# EAGLE design qo-100-pa-tec-controller (EAGLE 9.6.1)
CNAME: None; CREVISION: 1; DESIGNER: Joao Silva
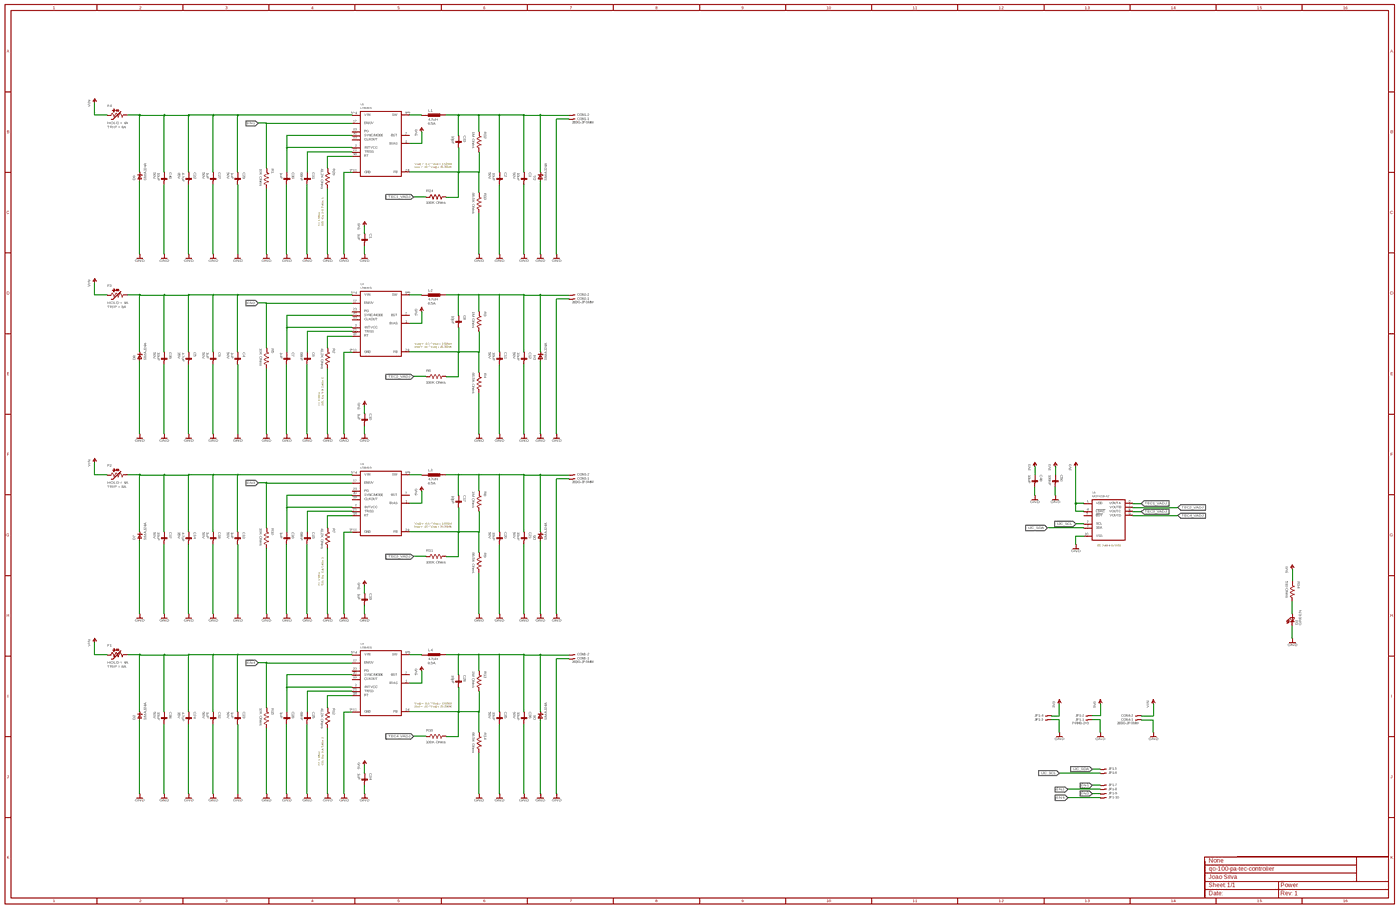
[diagram p0: schematic, sheet 1, overview]
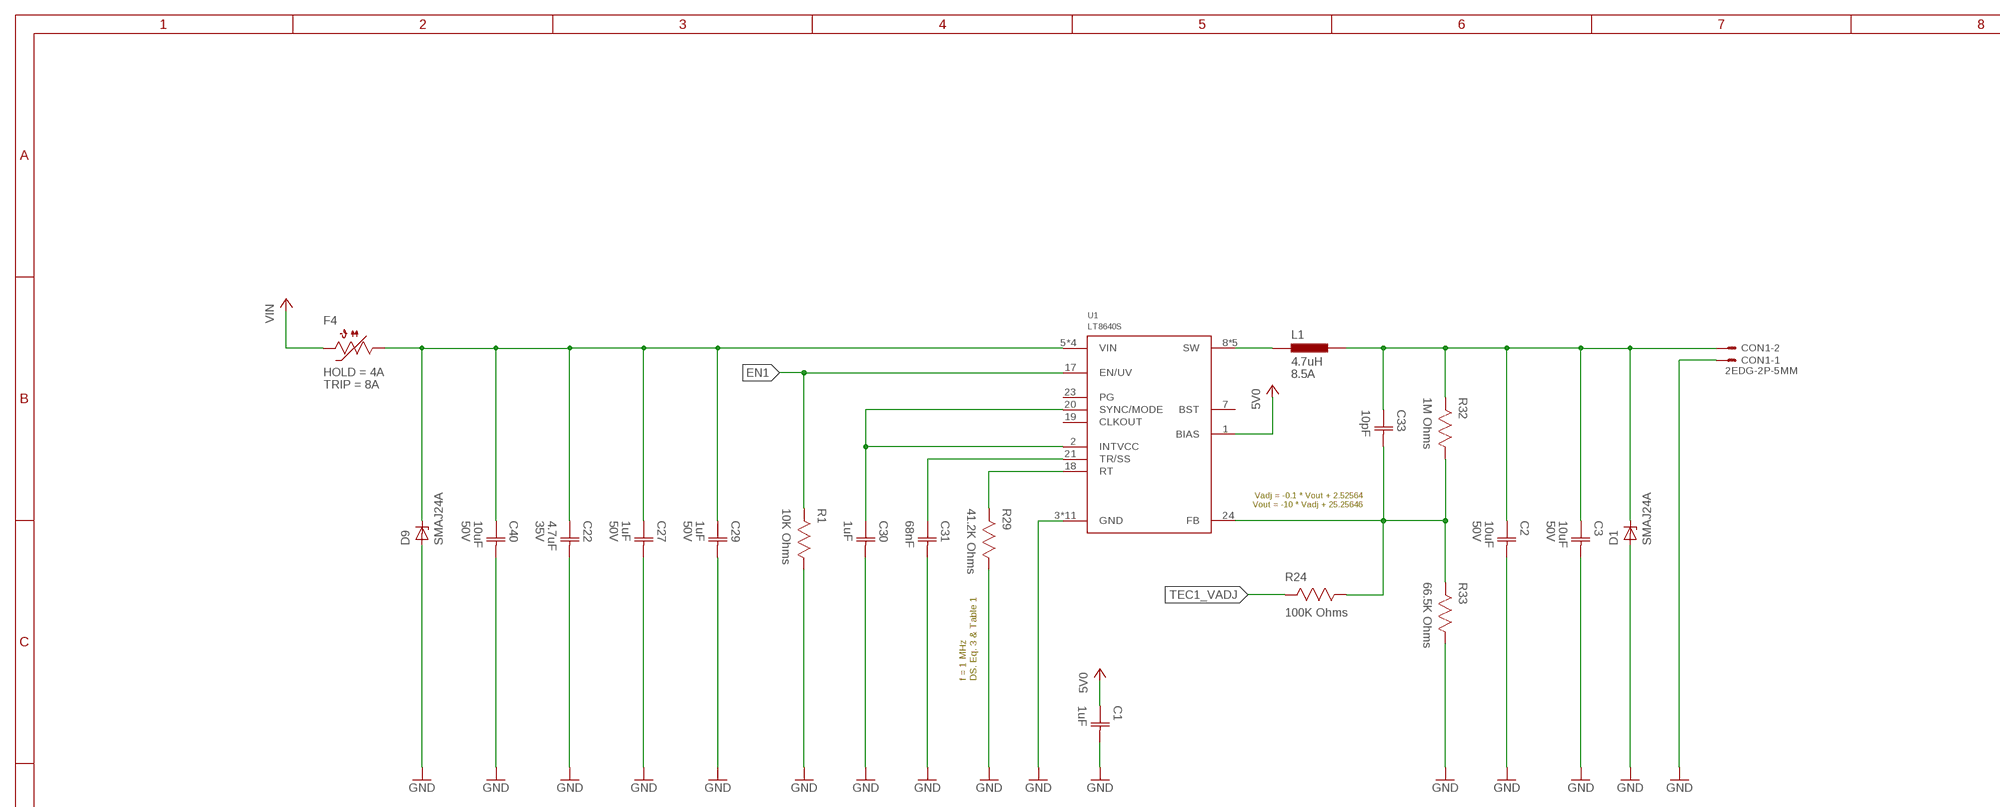
[diagram p1: schematic, sheet 1, part 1 of 4]
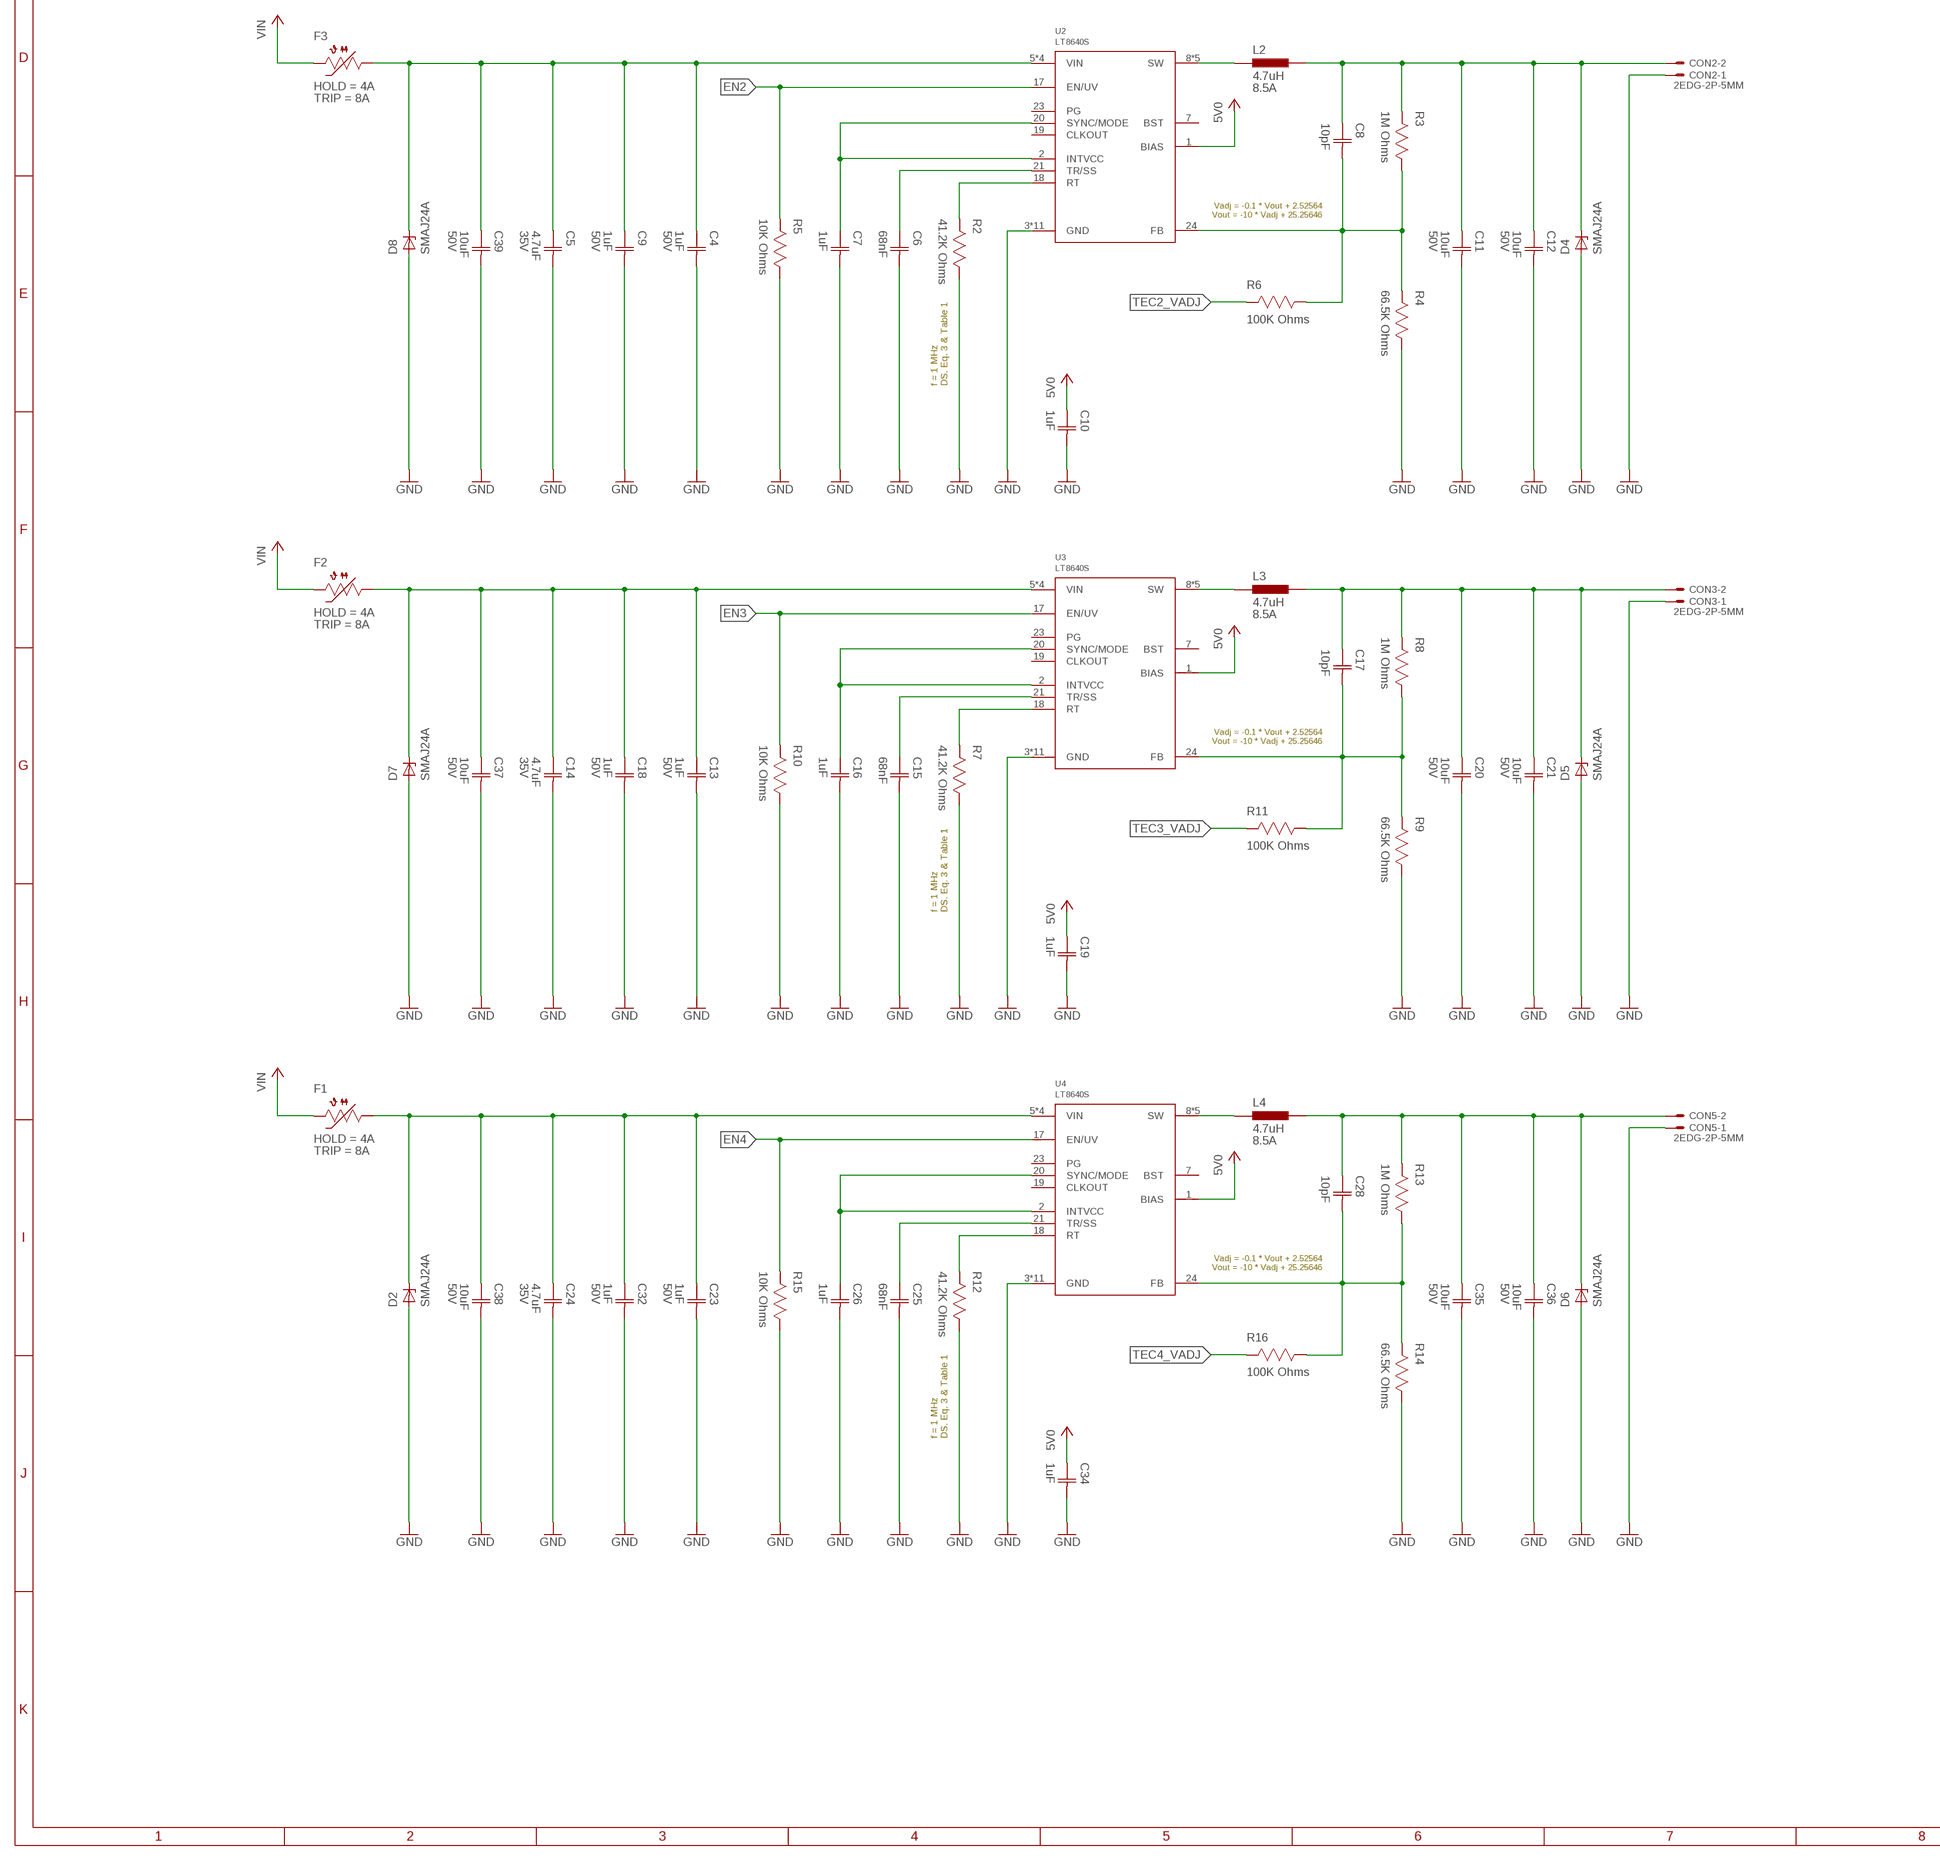
[diagram p2: schematic, sheet 1, part 2 of 4]
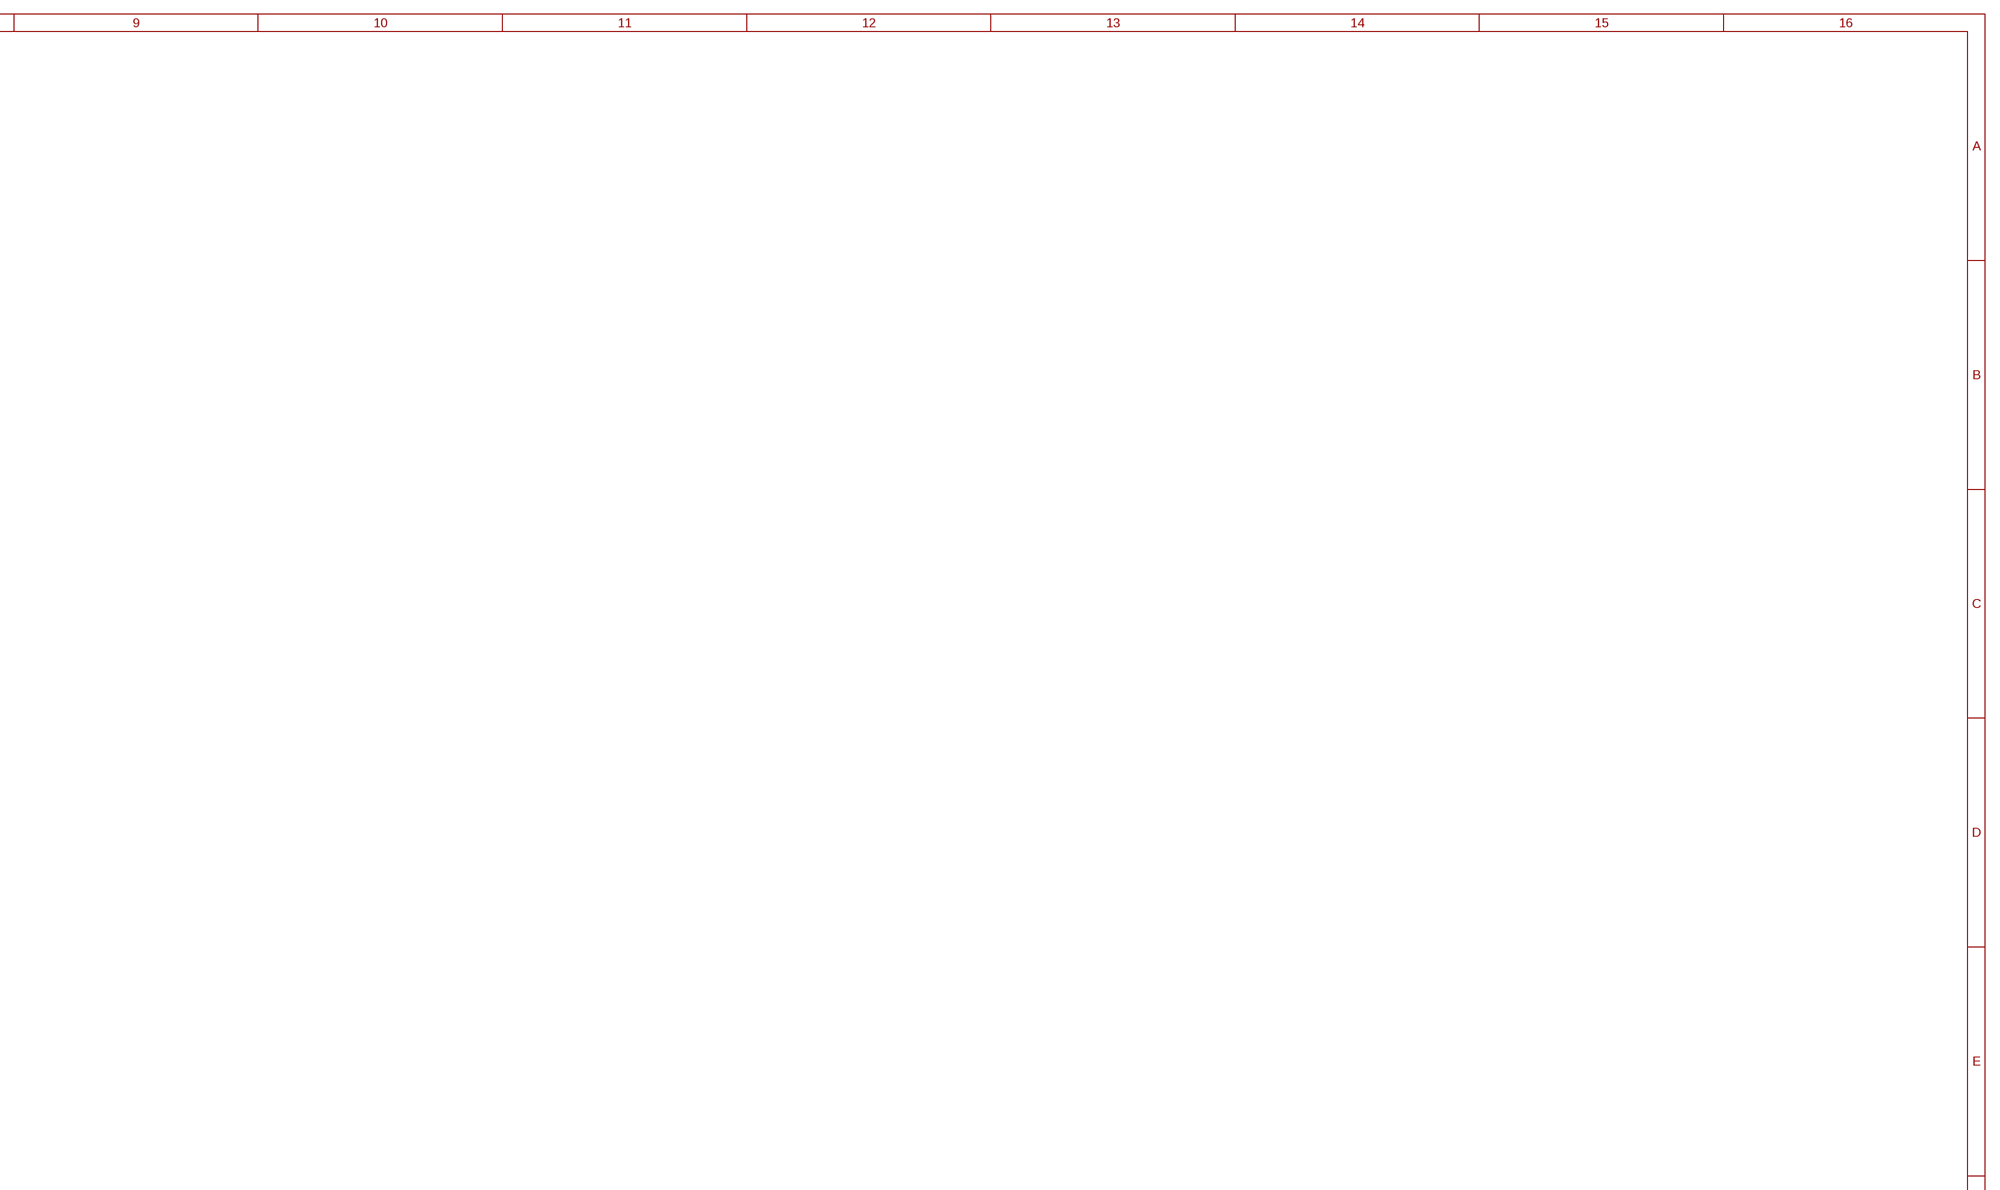
[diagram p3: schematic, sheet 1, part 3 of 4]
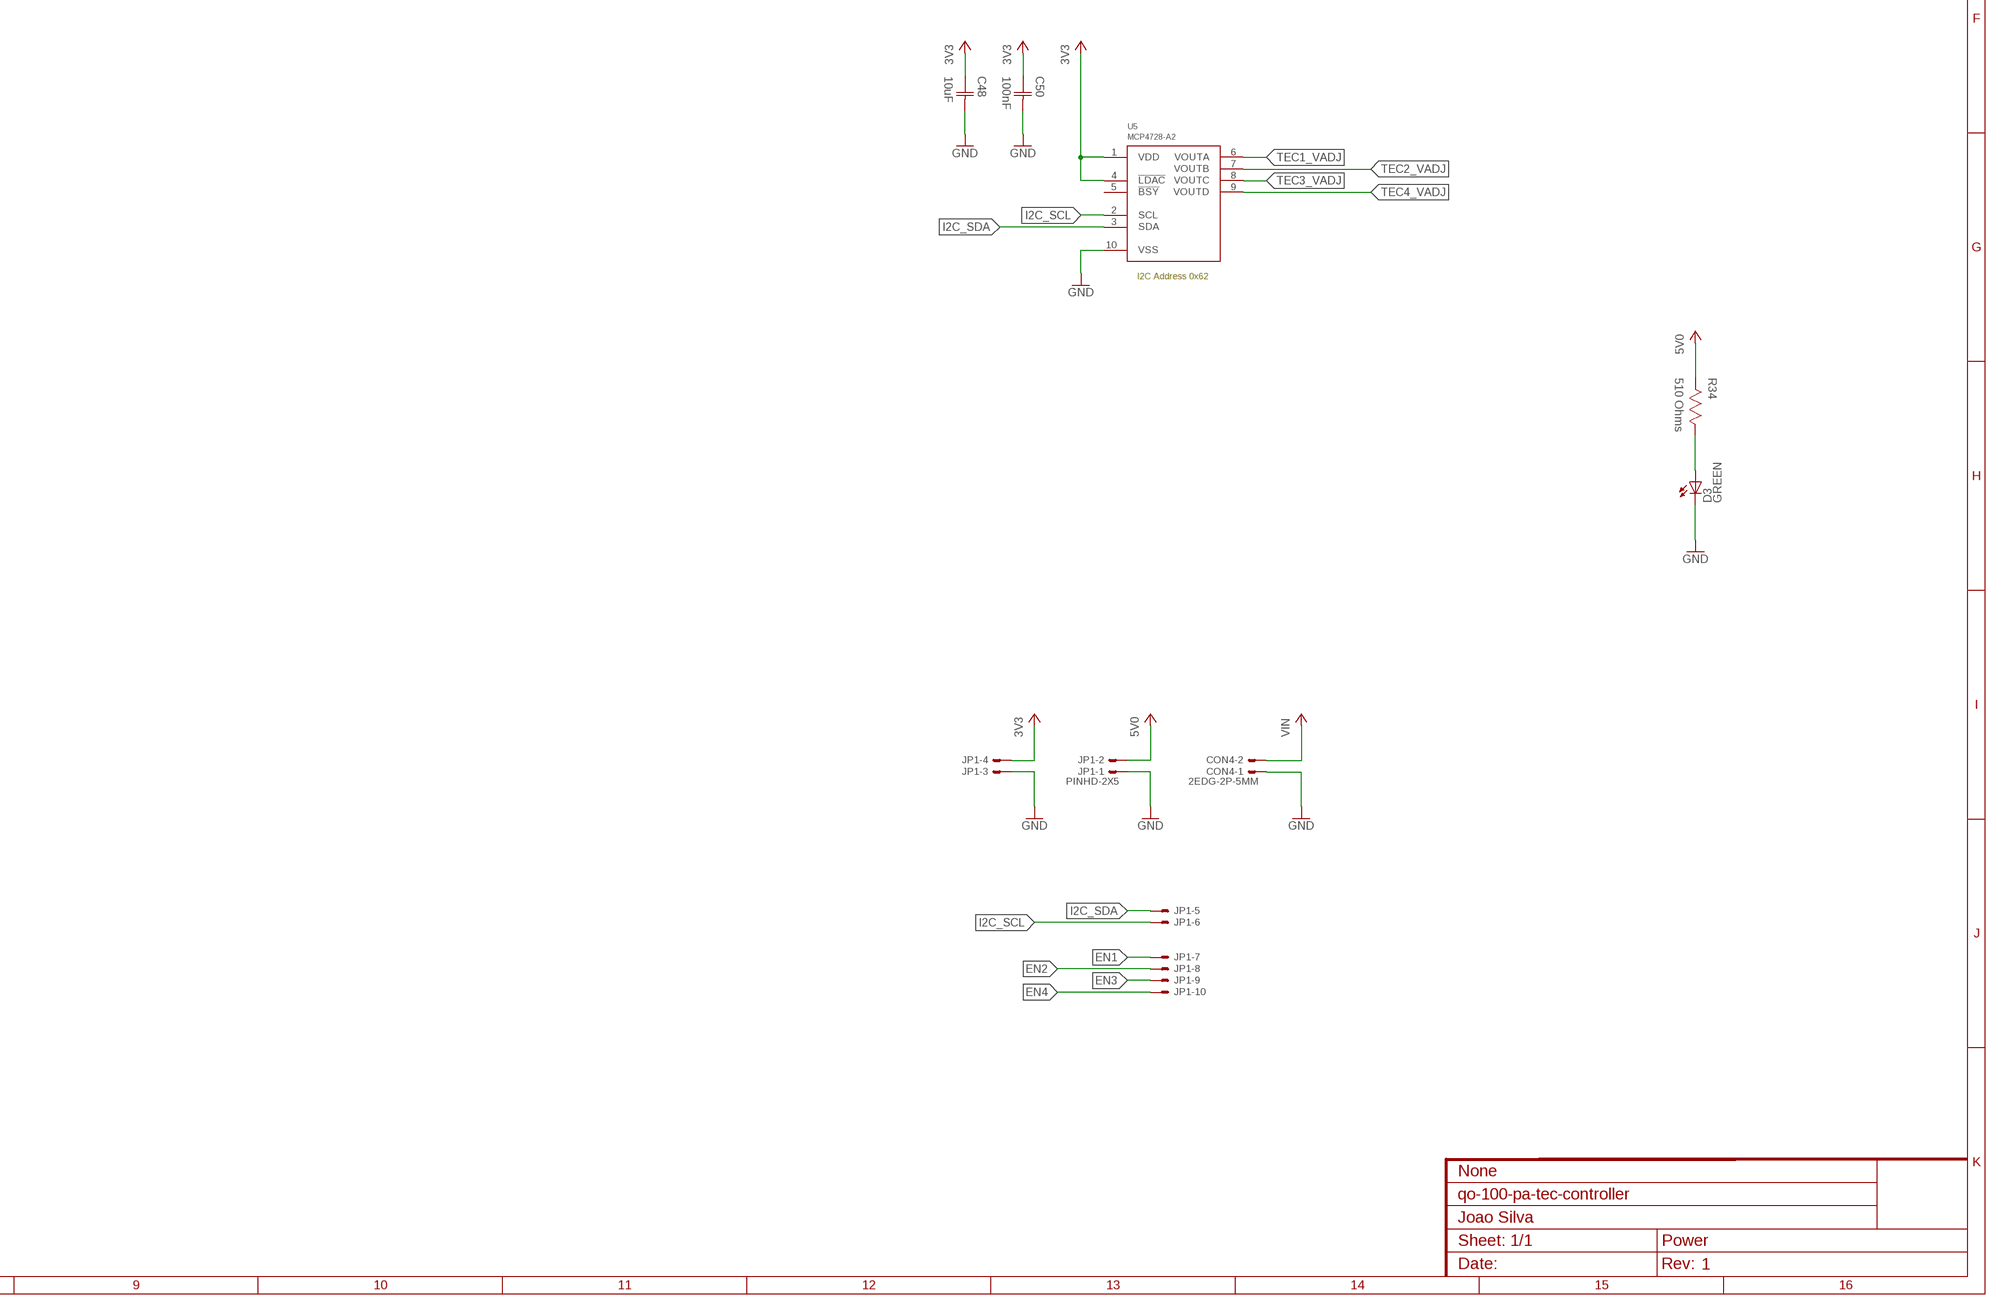
[diagram p4: schematic, sheet 1, part 4 of 4]

## Parts
C1  1uF  CAPACITOR-0603  [CAP0603]
C2  10uF  CAPACITOR-1206  [CAP1206]
C3  10uF  CAPACITOR-1206  [CAP1206]
C4  1uF  CAPACITOR-0603  [CAP0603]
C5  4.7uF  CAPACITOR-0603  [CAP0603]
C6  68nF  CAPACITOR-0603  [CAP0603]
C7  1uF  CAPACITOR-0603  [CAP0603]
C8  10pF  CAPACITOR-0603  [CAP0603]
C9  1uF  CAPACITOR-0603  [CAP0603]
C10  1uF  CAPACITOR-0603  [CAP0603]
C11  10uF  CAPACITOR-1206  [CAP1206]
C12  10uF  CAPACITOR-1206  [CAP1206]
C13  1uF  CAPACITOR-0603  [CAP0603]
C14  4.7uF  CAPACITOR-0603  [CAP0603]
C15  68nF  CAPACITOR-0603  [CAP0603]
C16  1uF  CAPACITOR-0603  [CAP0603]
C17  10pF  CAPACITOR-0603  [CAP0603]
C18  1uF  CAPACITOR-0603  [CAP0603]
C19  1uF  CAPACITOR-0603  [CAP0603]
C20  10uF  CAPACITOR-1206  [CAP1206]
C21  10uF  CAPACITOR-1206  [CAP1206]
C22  4.7uF  CAPACITOR-0603  [CAP0603]
C23  1uF  CAPACITOR-0603  [CAP0603]
C24  4.7uF  CAPACITOR-0603  [CAP0603]
C25  68nF  CAPACITOR-0603  [CAP0603]
C26  1uF  CAPACITOR-0603  [CAP0603]
C27  1uF  CAPACITOR-0603  [CAP0603]
C28  10pF  CAPACITOR-0603  [CAP0603]
C29  1uF  CAPACITOR-0603  [CAP0603]
C30  1uF  CAPACITOR-0603  [CAP0603]
C31  68nF  CAPACITOR-0603  [CAP0603]
C32  1uF  CAPACITOR-0603  [CAP0603]
C33  10pF  CAPACITOR-0603  [CAP0603]
C34  1uF  CAPACITOR-0603  [CAP0603]
C35  10uF  CAPACITOR-1206  [CAP1206]
C36  10uF  CAPACITOR-1206  [CAP1206]
C37  10uF  CAPACITOR-1206  [CAP1206]
C38  10uF  CAPACITOR-1206  [CAP1206]
C39  10uF  CAPACITOR-1206  [CAP1206]
C40  10uF  CAPACITOR-1206  [CAP1206]
C48  10uF  CAPACITOR-0603  [CAP0603]
C50  100nF  CAPACITOR-0603  [CAP0603]
CON1  2EDG-2P-5MM  [2EDG-2P-5MM]
CON2  2EDG-2P-5MM  [2EDG-2P-5MM]
CON3  2EDG-2P-5MM  [2EDG-2P-5MM]
CON4  2EDG-2P-5MM  [2EDG-2P-5MM]
CON5  2EDG-2P-5MM  [2EDG-2P-5MM]
D1  SMAJ24A  [DO214AC]
D2  SMAJ24A  [DO214AC]
D3  LED0603  [0603]
D4  SMAJ24A  [DO214AC]
D5  SMAJ24A  [DO214AC]
D6  SMAJ24A  [DO214AC]
D7  SMAJ24A  [DO214AC]
D8  SMAJ24A  [DO214AC]
D9  SMAJ24A  [DO214AC]
F1  2.6A Hold  PTC1206  [1206]
F2  2.6A Hold  PTC1206  [1206]
F3  2.6A Hold  PTC1206  [1206]
F4  2.6A Hold  PTC1206  [1206]
JP1  PINHD-2X5  [2X05]
L1  4.7uH  INDUCTOR-10.2X10.2X4MM  [IND1040]
L2  4.7uH  INDUCTOR-10.2X10.2X4MM  [IND1040]
L3  4.7uH  INDUCTOR-10.2X10.2X4MM  [IND1040]
L4  4.7uH  INDUCTOR-10.2X10.2X4MM  [IND1040]
R1  10K Ohms  RESISTOR-0603  [RES0603]
R2  41.2K Ohms  RESISTOR-0603  [RES0603]
R3  1M Ohms  RESISTOR-0603  [RES0603]
R4  66.5K Ohms  RESISTOR-0603  [RES0603]
R5  10K Ohms  RESISTOR-0603  [RES0603]
R6  100K Ohms  RESISTOR-0603  [RES0603]
R7  41.2K Ohms  RESISTOR-0603  [RES0603]
R8  1M Ohms  RESISTOR-0603  [RES0603]
R9  66.5K Ohms  RESISTOR-0603  [RES0603]
R10  10K Ohms  RESISTOR-0603  [RES0603]
R11  100K Ohms  RESISTOR-0603  [RES0603]
R12  41.2K Ohms  RESISTOR-0603  [RES0603]
R13  1M Ohms  RESISTOR-0603  [RES0603]
R14  66.5K Ohms  RESISTOR-0603  [RES0603]
R15  10K Ohms  RESISTOR-0603  [RES0603]
R16  100K Ohms  RESISTOR-0603  [RES0603]
R24  100K Ohms  RESISTOR-0603  [RES0603]
R29  41.2K Ohms  RESISTOR-0603  [RES0603]
R32  1M Ohms  RESISTOR-0603  [RES0603]
R33  66.5K Ohms  RESISTOR-0603  [RES0603]
R34  510 Ohms  RESISTOR-0603  [RES0603]
U1  LT8640S  [QFN24_CORNER]
U2  LT8640S  [QFN24_CORNER]
U3  LT8640S  [QFN24_CORNER]
U4  LT8640S  [QFN24_CORNER]
U5  MCP4728-A2  [MSOP10]

## Nets
3V3: C48.1(C1) C50.1(C1) JP1.4 U5.1(VDD) U5.4(!LDAC)
5V0: C1.1(C1) C10.1(C1) C19.1(C1) C34.1(C1) JP1.2 R34.2 U1.1(BIAS) U2.1(BIAS) U3.1(BIAS) U4.1(BIAS)
EN1: JP1.7 R1.2 U1.17(EN/UV)
EN2: JP1.8 R5.2 U2.17(EN/UV)
EN3: JP1.9 R10.2 U3.17(EN/UV)
EN4: JP1.10 R15.2 U4.17(EN/UV)
GND: C1.2(C2) C2.2(C2) C3.2(C2) C4.2(C2) C5.2(C2) C6.2(C2) C7.2(C2) C9.2(C2) C10.2(C2) C11.2(C2) C12.2(C2) C13.2(C2) C14.2(C2) C15.2(C2) C16.2(C2) C18.2(C2) C19.2(C2) C20.2(C2) C21.2(C2) C22.2(C2) C23.2(C2) C24.2(C2) C25.2(C2) C26.2(C2) C27.2(C2) C29.2(C2) C30.2(C2) C31.2(C2) C32.2(C2) C34.2(C2) C35.2(C2) C36.2(C2) C37.2(C2) C38.2(C2) C39.2(C2) C40.2(C2) C48.2(C2) C50.2(C2) CON1.P$1 CON2.P$1 CON3.P$1 CON4.P$1 CON5.P$1 D1.A D2.A D3.C D4.A D5.A D6.A D7.A D8.A D9.A JP1.1 JP1.3 R1.1 R2.1 R4.1 R5.1 R7.1 R9.1 R10.1 R12.1 R14.1 R15.1 R29.1 R33.1 U1.3(GND) U1.16(GND) U1.22(GND) U1.25(GND) U1.26(GND) U1.27(GND) U1.28(GND) U1.29(GND) U1.30(GND) U1.31(GND) U1.32(GND) U2.3(GND) U2.16(GND) U2.22(GND) U2.25(GND) U2.26(GND) U2.27(GND) U2.28(GND) U2.29(GND) U2.30(GND) U2.31(GND) U2.32(GND) U3.3(GND) U3.16(GND) U3.22(GND) U3.25(GND) U3.26(GND) U3.27(GND) U3.28(GND) U3.29(GND) U3.30(GND) U3.31(GND) U3.32(GND) U4.3(GND) U4.16(GND) U4.22(GND) U4.25(GND) U4.26(GND) U4.27(GND) U4.28(GND) U4.29(GND) U4.30(GND) U4.31(GND) U4.32(GND) U5.10(VSS)
I2C_SCL: JP1.6 U5.2(SCL)
I2C_SDA: JP1.5 U5.3(SDA)
N$149: D3.A R34.1
TEC1_VADJ: R24.2 U5.6(VOUTA)
TEC1_VIN: C22.1(C1) C27.1(C1) C29.1(C1) C40.1(C1) D9.C F4.1 U1.5(VIN) U1.6(VIN) U1.13(VIN) U1.14(VIN)
TEC2_VADJ: R6.2 U5.7(VOUTB)
TEC2_VIN: C4.1(C1) C5.1(C1) C9.1(C1) C39.1(C1) D8.C F3.1 U2.5(VIN) U2.6(VIN) U2.13(VIN) U2.14(VIN)
TEC3_VADJ: R11.2 U5.8(VOUTC)
TEC3_VIN: C13.1(C1) C14.1(C1) C18.1(C1) C37.1(C1) D7.C F2.1 U3.5(VIN) U3.6(VIN) U3.13(VIN) U3.14(VIN)
TEC4_VADJ: R16.2 U5.9(VOUTD)
TEC4_VIN: C23.1(C1) C24.1(C1) C32.1(C1) C38.1(C1) D2.C F1.1 U4.5(VIN) U4.6(VIN) U4.13(VIN) U4.14(VIN)
VIN: CON4.P$2 F1.2 F2.2 F3.2 F4.2
VTEC1: C2.1(C1) C3.1(C1) C33.1(C1) CON1.P$2 D1.C L1.2 R32.2
VTEC1_FB: C33.2(C2) R24.1 R32.1 R33.2 U1.24(FB)
VTEC1_INTVCC: C30.1(C1) U1.2(INTVCC) U1.20(SYNC/MODE)
VTEC1_RT: R29.2 U1.18(RT)
VTEC1_SS: C31.1(C1) U1.21(TR/SS)
VTEC1_SW: L1.1 U1.8(SW) U1.9(SW) U1.10(SW) U1.11(SW) U1.12(SW)
VTEC2: C8.1(C1) C11.1(C1) C12.1(C1) CON2.P$2 D4.C L2.2 R3.2
VTEC2_FB: C8.2(C2) R3.1 R4.2 R6.1 U2.24(FB)
VTEC2_INTVCC: C7.1(C1) U2.2(INTVCC) U2.20(SYNC/MODE)
VTEC2_RT: R2.2 U2.18(RT)
VTEC2_SS: C6.1(C1) U2.21(TR/SS)
VTEC2_SW: L2.1 U2.8(SW) U2.9(SW) U2.10(SW) U2.11(SW) U2.12(SW)
VTEC3: C17.1(C1) C20.1(C1) C21.1(C1) CON3.P$2 D5.C L3.2 R8.2
VTEC3_FB: C17.2(C2) R8.1 R9.2 R11.1 U3.24(FB)
VTEC3_INTVCC: C16.1(C1) U3.2(INTVCC) U3.20(SYNC/MODE)
VTEC3_RT: R7.2 U3.18(RT)
VTEC3_SS: C15.1(C1) U3.21(TR/SS)
VTEC3_SW: L3.1 U3.8(SW) U3.9(SW) U3.10(SW) U3.11(SW) U3.12(SW)
VTEC4: C28.1(C1) C35.1(C1) C36.1(C1) CON5.P$2 D6.C L4.2 R13.2
VTEC4_FB: C28.2(C2) R13.1 R14.2 R16.1 U4.24(FB)
VTEC4_INTVCC: C26.1(C1) U4.2(INTVCC) U4.20(SYNC/MODE)
VTEC4_RT: R12.2 U4.18(RT)
VTEC4_SS: C25.1(C1) U4.21(TR/SS)
VTEC4_SW: L4.1 U4.8(SW) U4.9(SW) U4.10(SW) U4.11(SW) U4.12(SW)
Unconnected: U1.7(BST) U1.19(CLKOUT) U1.23(PG) U2.7(BST) U2.19(CLKOUT) U2.23(PG) U3.7(BST) U3.19(CLKOUT) U3.23(PG) U4.7(BST) U4.19(CLKOUT) U4.23(PG) U5.5(!BSY)

## Notes on the sheet
- Vadj = -0.1 * Vout + 2.52564
  Vout = -10 * Vadj + 25.25646
- f = 1 MHz
  DS. Eq. 3 & Table 1
- Vadj = -0.1 * Vout + 2.52564
  Vout = -10 * Vadj + 25.25646
- f = 1 MHz
  DS. Eq. 3 & Table 1
- Vadj = -0.1 * Vout + 2.52564
  Vout = -10 * Vadj + 25.25646
- I2C Address 0x62
- f = 1 MHz
  DS. Eq. 3 & Table 1
- Vadj = -0.1 * Vout + 2.52564
  Vout = -10 * Vadj + 25.25646
- f = 1 MHz
  DS. Eq. 3 & Table 1

## Library data of the parts
C1 C6-C8 C10 C15-C17 C19 C25 C26 C28 C30 C31 C33 C34 C48 C50 = Capacitor:CAPACITOR
C2-C4 C9 C11-C13 C18 C20 C21 C23 C27 C29 C32 C35-C40 = Capacitor:CAPACITOR; VOLTAGE: 50V
C5 C14 C22 C24 = Capacitor:CAPACITOR; VOLTAGE: 35V
CON1-CON5 = Generic Connector:2EDG-2P
D1 D2 D4-D9 = TVS:SMAJ*A: SMAJ Series TVS Diodes Source: http://www.littelfuse.com/~/media/electronics/datasheets/tvs_diodes/littelfuse_tvs_diode_smaj_datasheet.pdf.pdf; MF: Littelfuse; MPN: SMAJ24A; OC_FARNELL: 1886345; OC_NEWARK: 06R1865
D3 = LED:LED; COLOR: GREEN
F1-F4 = PTC Fuses:PTC; HOLD: 4A; OCLCSC: C70173; TRIP: 8A
JP1 = Pin Header:PINHD-2X5: PIN HEADER
L1-L4 = Inductor:INDUCTOR; CURRENT: 8.5A; OCLCSC: C439301
R1-R16 R24 R29 R32-R34 = Resistor:RESISTOR
U1-U4 = Analog Devices:LT8640S
U5 = Microchip:MCP4728-A*

## Net classes
1 80V isolation: clearance 0.2 mm

## Board
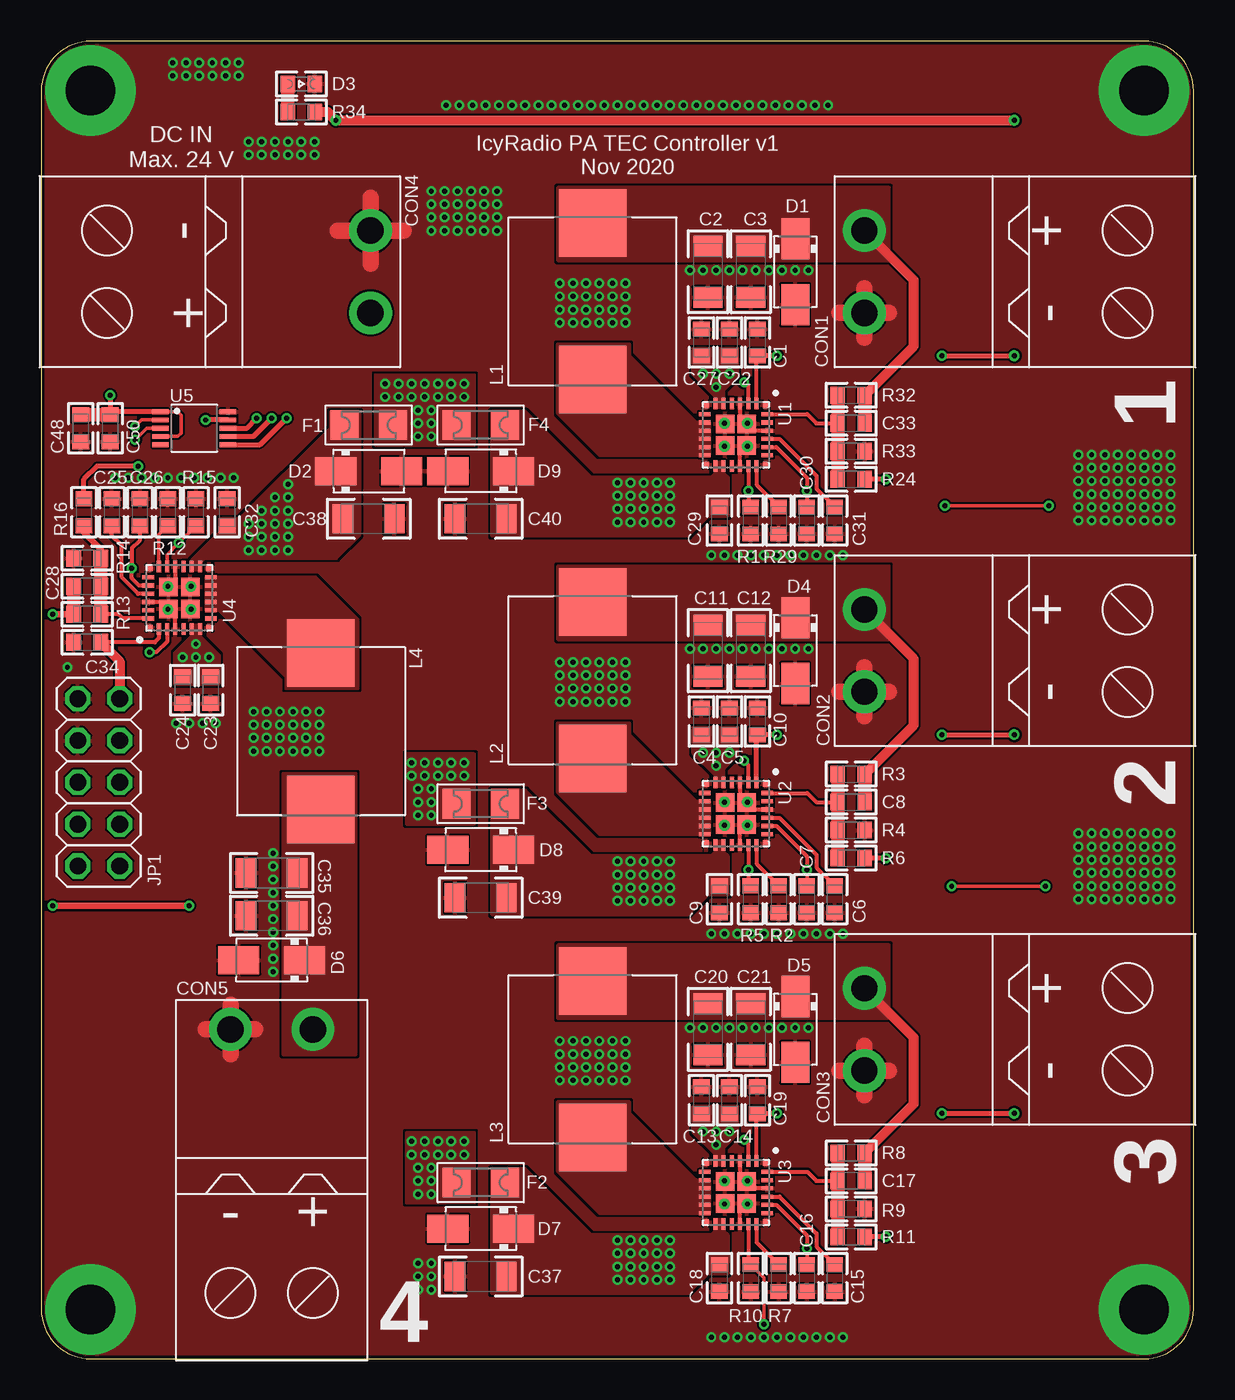
[diagram p5: board, top side]
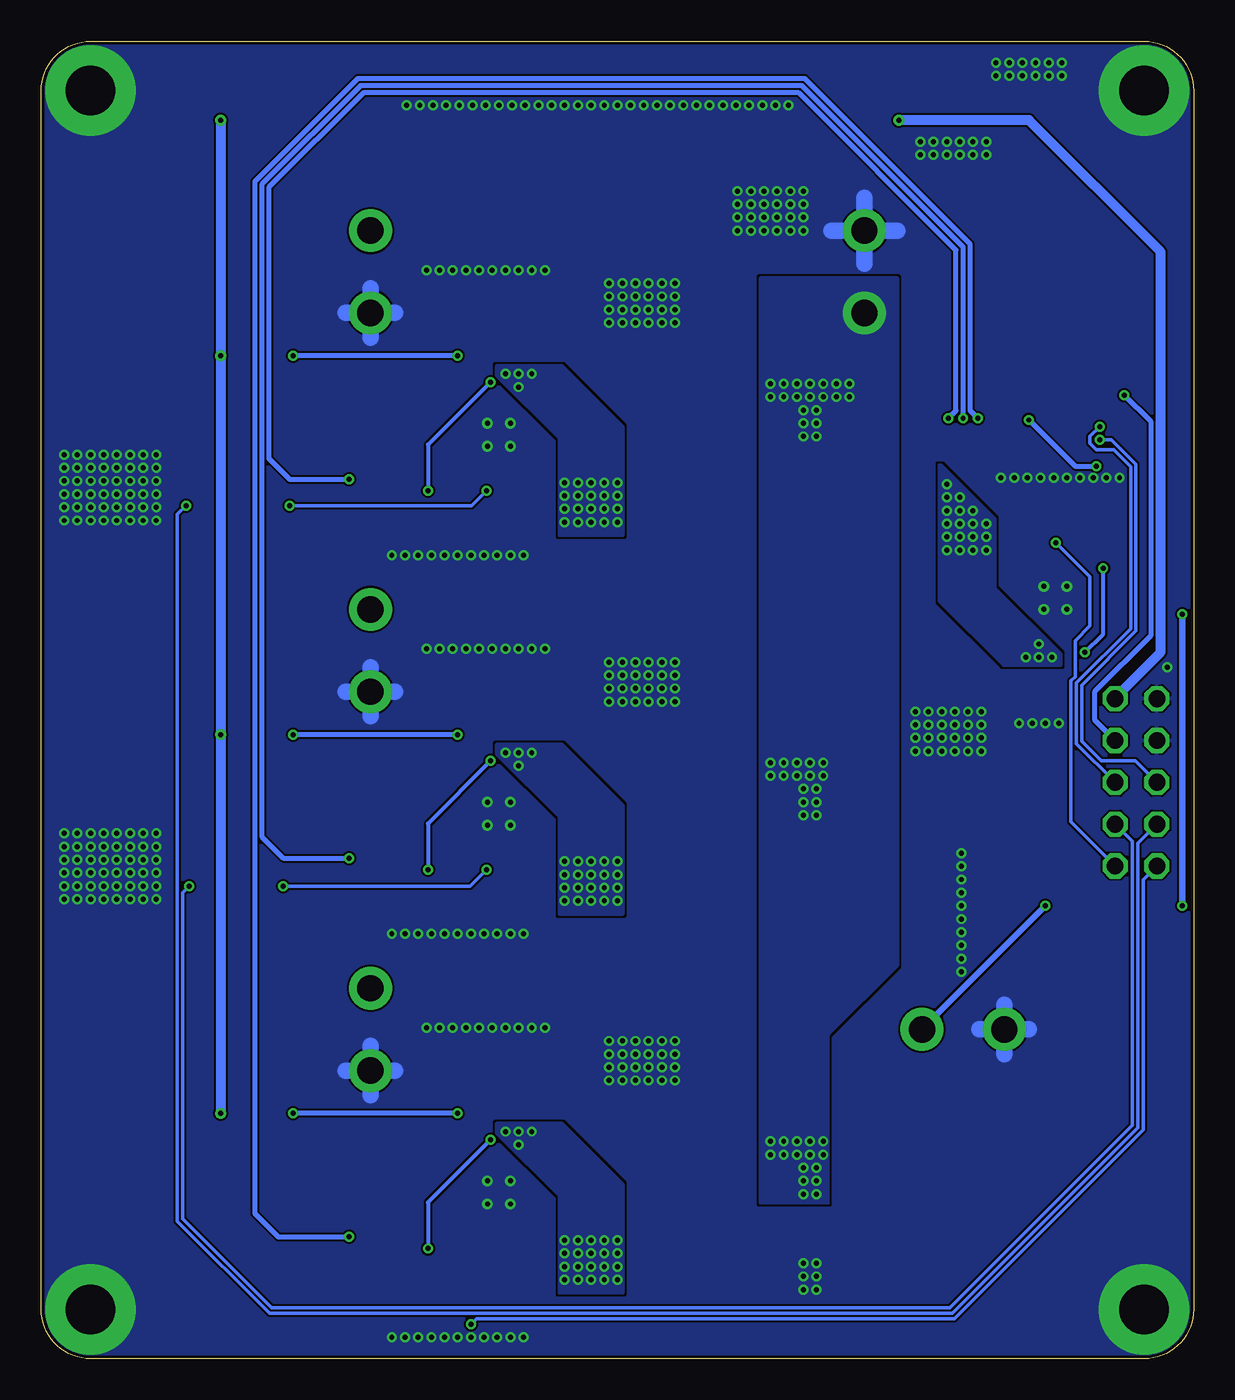
[diagram p6: board, bottom side, seen from below]

Size 70 x 80 mm. Coordinates in mm from the lower left corner, seen from the top.
Outline: 70,3 70,77 arc90 67,80 3,80 arc90 0,77 0,3 arc90 3,0 67,0 arc90 70,3
Copper layers (1*16): Top 0.035mm / dielectric 1.6mm / Bottom 0.035mm
Design rules "jlcpcb_2layer": minimum track width 5mil, minimum drill 0.3mm, track to track 5mil, track to pad 5mil, pad to pad 5mil, via to via 5mil, smd to smd 5mil, copper to edge 0.2mm, drill to drill 5mil, minimum pad ring 3mil, minimum via ring 3mil, stop-mask expansion 0.075mm, vias tented up to drill 10mm, thermal gap 5mil

### Footprints (pad centres in the part's own frame; a part is rotated, then mirrored left to right if it is on the bottom)
CAP0603 = smd 0.889 x 1.016: 1 -0.819,0; 2 0.819,0
CAP1206 = smd 1.27 x 1.778: 1 -1.549,0; 2 1.549,0
2EDG-2P-5MM = drill 1.6 pad 2.6: P$1 -2.5,0; P$2 2.5,0
DO214AC = smd 2.5 x 1.7: A 2,0; C -2,0
0603 = smd 0.889 x 1.016: A 0.819,0; C -0.819,0
1206 = smd 1.7 x 1.803: 1 -1.472,0; 2 1.472,0
2X05 = drill 1.016 octagon: 1 -5.08,-1.27; 2 -5.08,1.27; 3 -2.54,-1.27; 4 -2.54,1.27; 5 0,-1.27; 6 0,1.27; 7 2.54,-1.27; 8 2.54,1.27; 9 5.08,-1.27; 10 5.08,1.27
IND1040 = smd 4.1 x 4.1: 1 -4.75,0; 2 4.75,0
RES0603 = smd 0.889 x 1.016: 1 -0.819,0; 2 0.819,0
QFN24_CORNER = smd 0.7 x 0.25: 1 -1.9,1.25; 2 -1.9,0.75; 3 -1.9,0.25; 4 -1.9,-0.25; 5 -1.9,-0.75; 6 -1.9,-1.25; 13 1.9,-1.25; 14 1.9,-0.75; 15 1.9,-0.25; 16 1.9,0.25; 17 1.9,0.75; 18 1.9,1.25 | smd 0.25 x 0.7: 7 -1.25,-1.9; 8 -0.75,-1.9; 9 -0.25,-1.9; 10 0.25,-1.9; 11 0.75,-1.9; 12 1.25,-1.9; 19 1.25,1.9; 20 0.75,1.9; 21 0.25,1.9; 22 -0.25,1.9; 23 -0.75,1.9; 24 -1.25,1.9 | smd 1.125 x 1.125: 25 -0.662,0.662; 26 0.662,0.662; 27 -0.662,-0.662; 28 0.662,-0.662 | smd 0.375 x 0.375: 29 -1.812,1.812; 30 1.812,1.812; 31 1.812,-1.812; 32 -1.812,-1.812
MSOP10 = smd 0.3 x 1: 1 -1,-2.05; 2 -0.5,-2.05; 3 0,-2.05; 4 0.5,-2.05; 5 1,-2.05; 6 1,2.05; 7 0.5,2.05; 8 0,2.05; 9 -0.5,2.05; 10 -1,2.05

### Placement (x,y rotation side)
C1  43.5,61.7 90 top
C2  40.5,66 270 top
C3  43.1,66 270 top
C4  40.1,38.7 90 top
C5  41.8,38.7 90 top
C6  48.2,27.9 270 top
C7  46.5,27.9 270 top
C8  49.2,33.8 180 top
C9  41.2,27.9 270 top
C10  43.5,38.7 90 top
C11  40.5,43 270 top
C12  43.1,43 270 top
C13  40.1,15.7 90 top
C14  41.8,15.7 90 top
C15  48.2,4.9 270 top
C16  46.5,4.9 270 top
C17  49.2,10.8 180 top
C18  41.2,4.9 270 top
C19  43.5,15.7 90 top
C20  40.5,20 270 top
C21  43.1,20 270 top
C22  41.8,61.7 90 top
C23  10.3,40.6 270 top
C24  8.6,40.6 270 top
C25  4.3,51.4 90 top
C26  6,51.4 90 top
C27  40.1,61.7 90 top
C28  2.8,46.9 0 top
C29  41.2,50.9 270 top
C30  46.5,50.9 270 top
C31  48.2,50.9 270 top
C32  11.3,51.4 90 top
C33  49.2,56.8 180 top
C34  2.8,43.5 180 top
C35  14,29.5 180 top
C36  14,26.9 180 top
C37  26.7,5 180 top
C38  19.9,51 0 top
C39  26.7,28 180 top
C40  26.7,51 180 top
C48  2.4,56.5 270 top
C50  4.2,56.5 270 top
CON1  50,66 90 top
CON2  50,43 90 top
CON3  50,20 90 top
CON4  20,66 270 top
CON5  14,20 0 top
D1  45.8,66 270 top
D2  19.9,53.9 0 top
D3  15.8,77.4 180 top
D4  45.8,43 270 top
D5  45.8,20 270 top
D6  14,24.2 180 top
D7  26.7,7.9 180 top
D8  26.7,30.9 180 top
D9  26.7,53.9 180 top
F1  19.9,56.7 0 top
F2  26.7,10.7 180 top
F3  26.7,33.7 180 top
F4  26.7,56.7 180 top
JP1  3.5,35 270 top
L1  33.5,64.2 90 top
L2  33.5,41.2 90 top
L3  33.5,18.2 90 top
L4  17,38.1 270 top
R1  43.1,50.9 90 top
R2  44.8,27.9 90 top
R3  49.2,35.5 0 top
R4  49.2,32.1 180 top
R5  43.1,27.9 90 top
R6  49.2,30.4 0 top
R7  44.8,4.9 90 top
R8  49.2,12.5 0 top
R9  49.2,9.1 180 top
R10  43.1,4.9 90 top
R11  49.2,7.4 0 top
R12  7.7,51.4 270 top
R13  2.8,45.2 180 top
R14  2.8,48.6 0 top
R15  9.4,51.4 270 top
R16  2.6,51.4 90 top
R24  49.2,53.4 0 top
R29  44.8,50.9 90 top
R32  49.2,58.5 0 top
R33  49.2,55.1 180 top
R34  15.8,75.7 0 top
U1  42.2,56.1 270 top
U2  42.2,33.1 270 top
U3  42.2,10.1 270 top
U4  8.4,46.2 90 top
U5  9.3,56.5 270 top

### Tracks (layer width: path | path; a pad name or v marks a point on that pad's centre or on a via)
3V3  (via drill 0.3)
  Top 0.2: U5.4 8.3,56 8.5,56.2 8.5,57.3 8.3,57.5 U5.1
  Top 0.305: U5.1 4.38,57.5 C50.1 v4.2,58.5
  Top 0.813: C48.1 C50.1
  Bottom 0.305: JP1.4 6,38.77 6,40.53 2.58,43.94 2.58,56.88 v4.2,58.5
5V0  (via drill 0.3, 0.3 pad 0.65)
  Top 0.254: U4.1 7.15,43.75 6.9,43.5 C34.1 | U3.1 43.45,14.83 43.52,14.9 | U1.1 43.45,60.83 43.52,60.9
  Top 0.305: C19.1 43.52,14.9 v44.7,14.9 | v44.7,60.9 43.52,60.9 C1.1 | v44.7,37.9 43.52,37.9 C10.1 43.45,37.83 U2.1 | v54.7,14.9 v59.1,14.9 | v54.7,37.9 v59.1,37.9 | v54.7,60.9 v59.1,60.9
  Top 0.61: C34.1 4.77,42.35 JP1.2 | R34.2 17.4,75.7 v17.9,75.2 v59.1,75.2
  Bottom 0.305: v44.7,60.9 v54.7,60.9 | v44.7,14.9 v54.7,14.9 | v44.7,37.9 v54.7,37.9
  Bottom 0.61: v17.9,75.2 10,75.2 2,67.2 2,42.9 4.77,40.13 JP1.2 | v59.1,75.2 v59.1,60.9 v59.1,37.9 v59.1,14.9
EN1  (via drill 0.3)
  Top 0.2: v61.2,51.8 v54.9,51.8
  Top 0.254: U1.17 v42.95,52.7 42.95,51.87 R1.2
  Bottom 0.2: JP1.7 3.4,31.29 3.4,14.04 14.66,2.77 56.13,2.77 61.73,8.37 61.73,51.27 v61.2,51.8 | v54.9,51.8 43.85,51.8 v42.95,52.7
EN2  (via drill 0.3)
  Top 0.2: v61,28.7 v55.3,28.7
  Top 0.254: U2.17 v42.95,29.7 42.95,28.87 R5.2
  Bottom 0.2: JP1.8 3.73,31.42 3.73,14.17 14.8,3.1 56,3.1 61.4,8.5 61.4,28.3 v61,28.7 | v55.3,28.7 43.95,28.7 v42.95,29.7
EN3  (via drill 0.3)
  Top 0.2: v43.9,2.1 43.9,4.92 R10.2
  Top 0.254: U3.17 42.95,5.87 R10.2
  Bottom 0.2: JP1.9 3.07,29.08 3.07,13.9 14.53,2.45 43.55,2.45 v43.9,2.1
EN4  (via drill 0.3)
  Top 0.2: U4.17 7.65,48.83 v8.36,49.54 R15.2
  Bottom 0.2: v8.36,49.54 6.3,47.48 6.3,44.5 7.2,43.6 7.2,41.42 7.45,41.17 7.45,32.6 JP1.10
GND  (via drill 0.3, 0.3 pad 0.65, 3 pad 5.5)
  Top 0.254: U1.3 42.45,57.17 U1.25 43.27,56.35 U1.22 | U1.16 42.45,55.02 U1.26 | U2.3 42.45,34.17 U2.25 43.27,33.35 U2.22 | U2.16 42.45,32.02 U2.26 | U3.22 43.27,10.35 U3.25 42.45,11.18 U3.3 | U3.16 42.45,9.03 U3.26 | U4.3 8.15,45.12 U4.25 7.33,45.95 U4.22 | U4.16 8.15,47.27 U4.26
  Top 1.016: CON4.P$1 22,68.5 | CON4.P$1 20,70.5 | CON4.P$1 18,68.5 | CON4.P$1 20,66.5 | CON1.P$1 51.5,63.5 | CON1.P$1 50,65 | CON1.P$1 48.5,63.5 | CON1.P$1 50,62 | CON5.P$1 13,20 | CON5.P$1 11.5,21.5 | CON5.P$1 10,20 | CON5.P$1 11.5,18.5 | CON3.P$1 51.5,17.5 | CON3.P$1 50,19 | CON3.P$1 48.5,17.5 | CON3.P$1 50,16 | CON2.P$1 51.5,40.5 | CON2.P$1 50,42 | CON2.P$1 48.5,40.5 | CON2.P$1 50,39
  Bottom 1.016: CON4.P$1 22,68.5 | CON4.P$1 20,70.5 | CON4.P$1 18,68.5 | CON4.P$1 20,66.5 | CON1.P$1 51.5,63.5 | CON1.P$1 50,65 | CON1.P$1 48.5,63.5 | CON1.P$1 50,62 | CON5.P$1 13,20 | CON5.P$1 11.5,21.5 | CON5.P$1 10,20 | CON5.P$1 11.5,18.5 | CON3.P$1 51.5,17.5 | CON3.P$1 50,19 | CON3.P$1 48.5,17.5 | CON3.P$1 50,16 | CON2.P$1 51.5,40.5 | CON2.P$1 50,42 | CON2.P$1 48.5,40.5 | CON2.P$1 50,39
  other vias: 67,3 67,77 3,77 3,3 41.5,55.4 41.5,56.8 42.9,56.8 42.9,55.4 41.5,32.4 41.5,33.8 42.9,33.8 42.9,32.4 41.5,9.4 41.5,10.8 42.9,10.8 42.9,9.4 7.7,45.5 7.7,46.9 9.1,46.9 9.1,45.5 28.6,76.1 27.8,76.1 27,76.1 26.2,76.1 25.4,76.1 24.6,76.1 43,76.1 42.2,76.1 41.4,76.1 40.6,76.1 39.8,76.1 39,76.1 47.8,76.1 47,76.1 46.2,76.1 45.4,76.1 44.6,76.1 43.8,76.1 38.2,76.1 37.4,76.1 36.6,76.1 35.8,76.1 35,76.1 34.2,76.1 33.4,76.1 32.6,76.1 31.8,76.1 31,76.1 30.2,76.1 29.4,76.1 27.7,70.9 26.9,70.9 26.1,70.9 25.3,70.9 24.5,70.9 23.7,70.9 27.7,70.1 26.9,70.1 26.1,70.1 25.3,70.1 24.5,70.1 23.7,70.1 27.7,69.3 26.9,69.3 26.1,69.3 25.3,69.3 24.5,69.3 23.7,69.3 27.7,68.5 26.9,68.5 26.1,68.5 25.3,68.5 24.5,68.5 23.7,68.5 16.6,73.1 15.8,73.1 15,73.1 14.2,73.1 13.4,73.1 12.6,73.1 16.6,73.9 15.8,73.9 15,73.9 14.2,73.9 13.4,73.9 12.6,73.9 12,77.9 11.2,77.9 10.4,77.9 9.6,77.9 8.8,77.9 8,77.9 12,78.7 11.2,78.7 10.4,78.7 9.6,78.7 8.8,78.7 8,78.7 35.5,65.3 34.7,65.3 33.9,65.3 33.1,65.3 32.3,65.3 31.5,65.3 35.5,64.5 34.7,64.5 33.9,64.5 33.1,64.5 32.3,64.5 31.5,64.5 35.5,63.7 34.7,63.7 33.9,63.7 33.1,63.7 32.3,63.7 31.5,63.7 35.5,62.9 34.7,62.9 33.9,62.9 33.1,62.9 32.3,62.9 31.5,62.9 35.5,42.3 34.7,42.3 33.9,42.3 33.1,42.3 32.3,42.3 31.5,42.3 35.5,41.5 34.7,41.5 33.9,41.5 33.1,41.5 32.3,41.5 31.5,41.5 35.5,40.7 34.7,40.7 33.9,40.7 33.1,40.7 32.3,40.7 31.5,40.7 35.5,39.9 34.7,39.9 33.9,39.9 33.1,39.9 32.3,39.9 31.5,39.9 35.5,19.3 34.7,19.3 33.9,19.3 33.1,19.3 32.3,19.3 31.5,19.3 35.5,18.5 34.7,18.5 33.9,18.5 33.1,18.5 32.3,18.5 31.5,18.5 35.5,17.7 34.7,17.7 33.9,17.7 33.1,17.7 32.3,17.7 31.5,17.7 35.5,16.9 34.7,16.9 33.9,16.9 33.1,16.9 32.3,16.9 31.5,16.9 12.9,36.9 13.7,36.9 14.5,36.9 15.3,36.9 16.1,36.9 16.9,36.9 12.9,37.7 13.7,37.7 14.5,37.7 15.3,37.7 16.1,37.7 16.9,37.7 12.9,38.5 13.7,38.5 14.5,38.5 15.3,38.5 16.1,38.5 16.9,38.5 12.9,39.3 13.7,39.3 14.5,39.3 15.3,39.3 16.1,39.3 16.9,39.3 63,54.9 63,54.1 63,53.3 63,52.5 63,51.7 63,50.9 63.8,54.9 63.8,54.1 63.8,53.3 63.8,52.5 63.8,51.7 63.8,50.9 64.6,54.9 64.6,54.1 64.6,53.3 64.6,52.5 64.6,51.7 64.6,50.9 65.4,54.9 65.4,54.1 65.4,53.3 65.4,52.5 65.4,51.7 65.4,50.9 66.2,54.9 66.2,54.1 66.2,53.3 66.2,52.5 66.2,51.7 66.2,50.9 67,54.9 67,54.1 67,53.3 67,52.5 67,51.7 67,50.9 67.8,54.9 67.8,54.1 67.8,53.3 67.8,52.5 67.8,51.7 67.8,50.9 68.6,54.9 68.6,54.1 68.6,53.3 68.6,52.5 68.6,51.7 68.6,50.9 63,31.9 63,31.1 63,30.3 63,29.5 63,28.7 63,27.9 63.8,31.9 63.8,31.1 63.8,30.3 63.8,29.5 63.8,28.7 63.8,27.9 64.6,31.9 64.6,31.1 64.6,30.3 64.6,29.5 64.6,28.7 64.6,27.9 65.4,31.9 65.4,31.1 65.4,30.3 65.4,29.5 65.4,28.7 65.4,27.9 66.2,31.9 66.2,31.1 66.2,30.3 66.2,29.5 66.2,28.7 66.2,27.9 67,31.9 67,31.1 67,30.3 67,29.5 67,28.7 67,27.9 67.8,31.9 67.8,31.1 67.8,30.3 67.8,29.5 67.8,28.7 67.8,27.9 68.6,31.9 68.6,31.1 68.6,30.3 68.6,29.5 68.6,28.7 68.6,27.9 47.1,25.8 47.9,25.8 48.7,25.8 40.7,25.8 41.5,25.8 42.3,25.8 43.1,25.8 43.9,25.8 44.7,25.8 45.5,25.8 46.3,25.8 47.1,1.3 47.9,1.3 48.7,1.3 40.7,1.3 41.5,1.3 42.3,1.3 43.1,1.3 43.9,1.3 44.7,1.3 45.5,1.3 46.3,1.3 47.1,48.8 47.9,48.8 48.7,48.8 40.7,48.8 41.5,48.8 42.3,48.8 43.1,48.8 43.9,48.8 44.7,48.8 45.5,48.8 46.3,48.8 41.8,66.1 41,66.1 40.2,66.1 39.4,66.1 46.6,66.1 45.8,66.1 45,66.1 44.2,66.1 43.4,66.1 42.6,66.1 41.8,20.1 41,20.1 40.2,20.1 39.4,20.1 46.6,20.1 45.8,20.1 45,20.1 44.2,20.1 43.4,20.1 42.6,20.1 41.8,43.1 41,43.1 40.2,43.1 39.4,43.1 46.6,43.1 45.8,43.1 45,43.1 44.2,43.1 43.4,43.1 42.6,43.1 14.1,25.9 14.1,25.1 14.1,24.3 14.1,23.5 14.1,30.7 14.1,29.9 14.1,29.1 14.1,28.3 14.1,27.5 14.1,26.7 6.9,53.5 6.1,53.5 5.3,53.5 4.5,53.5 11.7,53.5 10.9,53.5 10.1,53.5 9.3,53.5 8.5,53.5 7.7,53.5 8.2,38.6 9,38.6 9.8,38.6 10.6,38.6 1.6,42 22.9,5.8 22.9,5 22.9,4.2 23.7,5.8 23.7,5 23.7,4.2
  pour Top (rank 6): -1,81 71,81 71,-1 -1,-1
  pour Bottom (rank 6): -2,82 72,82 72,-2 -2,-2
I2C_SCL  (via drill 0.3)
  Top 0.2: U5.2 6.1,57 v5.7,56.6
  Bottom 0.2: JP1.6 7.13,37.36 7.13,41.03 3.83,44.34 3.83,54.16 4.86,55.2 5.9,55.2 6.3,55.6 6.3,56 v5.7,56.6
I2C_SDA  (via drill 0.3)
  Top 0.2: U5.3 6.4,56.5 v5.7,55.8
  Bottom 0.2: JP1.5 3.53,36.3 5.61,36.3 6.8,37.49 6.8,40.9 3.5,44.2 3.5,54.3 5,55.8 v5.7,55.8
N$149
  Top 0.813: R34.1 D3.A
TEC1_VADJ  (via drill 0.3)
  Top 0.305: U5.6 13.3,55.5 v14.9,57.1 | v51.3,53.4 R24.2
  Bottom 0.305: v14.9,57.1 14.43,57.57 14.43,67.32 23.98,76.87 50.42,76.87 56.17,71.12 56.17,54.67 54.9,53.4 v51.3,53.4
TEC1_VIN  (via drill 0.3)
  other vias: 38.2,53.2 37.4,53.2 36.6,53.2 35.8,53.2 35,53.2 38.2,52.4 37.4,52.4 36.6,52.4 35.8,52.4 35,52.4 38.2,51.6 37.4,51.6 36.6,51.6 35.8,51.6 35,51.6 38.2,50.8 37.4,50.8 36.6,50.8 35.8,50.8 35,50.8 41.8,59.8 41,59.8 40.2,59.8 41,59
  pour Top (no thermals): 27.4,50 39.3,50 40.5,51.2 41.7,51.2 41.7,53.5 41.45,53.75 41.45,54.4 40.95,54.4 40.95,53.75 40.7,53.5 33.4,53.5 29.4,57.5 27.4,57.5
  pour Bottom: 38.5,50 38.5,55.9 42.3,59.7 42.3,60.3 38.4,60.3 34.7,56.6 34.7,50
  pour Top (no thermals): 41.45,57.8 41.45,58.85 42.3,59.7 42.3,61.3 39.6,61.3 39.6,59.8 40.95,58.45 40.95,57.8
TEC2_VADJ  (via drill 0.3)
  Top 0.305: U5.7 12.9,56 v14,57.1 | v51.3,30.4 R6.2
  Bottom 0.305: v14,57.1 14,67.5 23.8,77.3 50.6,77.3 56.6,71.3 56.6,31.7 55.3,30.4 v51.3,30.4
TEC2_VIN  (via drill 0.3)
  other vias: 38.2,30.2 37.4,30.2 36.6,30.2 35.8,30.2 35,30.2 38.2,29.4 37.4,29.4 36.6,29.4 35.8,29.4 35,29.4 38.2,28.6 37.4,28.6 36.6,28.6 35.8,28.6 35,28.6 38.2,27.8 37.4,27.8 36.6,27.8 35.8,27.8 35,27.8 41.8,36.8 41,36.8 40.2,36.8 41,36
  pour Top (no thermals): 27.4,27 39.3,27 40.5,28.2 41.7,28.2 41.7,30.5 41.45,30.75 41.45,31.4 40.95,31.4 40.95,30.75 40.7,30.5 33.4,30.5 29.4,34.5 27.4,34.5
  pour Bottom: 38.5,27 38.5,32.9 42.3,36.7 42.3,37.3 38.4,37.3 34.7,33.6 34.7,27
  pour Top (no thermals): 41.45,34.8 41.45,35.85 42.3,36.7 42.3,38.3 39.6,38.3 39.6,36.8 40.95,35.45 40.95,34.8
TEC3_VADJ  (via drill 0.3)
  Top 0.305: U5.8 12.5,56.5 v13.1,57.1 | v51.3,7.4 R11.2
  Bottom 0.305: v13.1,57.1 13.57,57.57 13.57,67.68 23.62,77.73 50.78,77.73 57.03,71.48 57.03,8.83 55.6,7.4 v51.3,7.4
TEC3_VIN  (via drill 0.3)
  other vias: 38.2,7.2 37.4,7.2 36.6,7.2 35.8,7.2 35,7.2 38.2,6.4 37.4,6.4 36.6,6.4 35.8,6.4 35,6.4 38.2,5.6 37.4,5.6 36.6,5.6 35.8,5.6 35,5.6 38.2,4.8 37.4,4.8 36.6,4.8 35.8,4.8 35,4.8 41.8,13.8 41,13.8 40.2,13.8 41,13
  pour Top (no thermals): 27.4,4 39.3,4 40.5,5.2 41.7,5.2 41.7,7.5 41.45,7.75 41.45,8.4 40.95,8.4 40.95,7.75 40.7,7.5 33.4,7.5 29.4,11.5 27.4,11.5
  pour Bottom: 38.5,4 38.5,9.9 42.3,13.7 42.3,14.3 38.4,14.3 34.7,10.6 34.7,4
  pour Top (no thermals): 41.45,11.8 41.45,12.85 42.3,13.7 42.3,15.3 39.6,15.3 39.6,13.8 40.95,12.45 40.95,11.8
TEC4_VADJ  (via drill 0.3)
  Top 0.305: U5.9 v10,57 | v5.9,54.2 3.4,54.2 2.6,53.4 R16.2
  Bottom 0.305: v10,57 7.2,54.2 v5.9,54.2
TEC4_VIN  (via drill 0.3)
  other vias: 10.2,42.6 8.6,42.6 9.4,42.6 9.4,43.4 12.6,50.7 12.6,49.9 12.6,49.1 15,53.1 13.4,51.5 13.4,50.7 13.4,49.9 13.4,49.1 14.2,52.3 14.2,51.5 14.2,50.7 14.2,49.9 14.2,49.1 15,52.3 15,51.5 15,50.7 15,49.9 15,49.1
  pour Top (no thermals): 9.15,47.9 9.15,48.45 10.9,50.2 10.9,51 12.1,51 17.6,56.5 17.6,57.5 19.3,57.5 19.3,50 17.9,48.6 9.9,48.6 9.65,48.35 9.65,47.9
  pour Top (no thermals): 9.15,44.5 9.15,43.85 8.1,42.8 8.1,41 10.8,41 10.8,42.7 9.65,43.85 9.65,44.5
  pour Bottom: 8.1,42.1 11.5,42.1 15.4,46 15.4,54.3 12.1,51 12.1,46.8 8.1,42.8
VIN  (via drill 0.3)
  other vias: 22.9,57.6 23.7,57.6 22.9,56.8 22.9,56 23.7,56.8 23.7,56 24.1,59.2 23.3,59.2 22.5,59.2 21.7,59.2 20.9,59.2 24.1,58.4 23.3,58.4 22.5,58.4 21.7,58.4 20.9,58.4 25.7,59.2 24.9,59.2 25.7,58.4 24.9,58.4 25.7,12.4 24.9,12.4 25.7,13.2 24.1,12.4 24.9,13.2 22.5,12.4 22.5,13.2 24.1,13.2 23.3,13.2 22.9,10 22.9,10.8 23.3,12.4 22.9,11.6 23.7,11.6 23.7,10.8 23.7,10 25.7,35.4 24.9,35.4 25.7,36.2 24.1,35.4 24.9,36.2 22.5,35.4 22.5,36.2 24.1,36.2 23.3,36.2 22.9,33 22.9,33.8 23.3,35.4 22.9,34.6 23.7,34.6 23.7,33.8 23.7,33
  pour Bottom (no thermals): 18,65.6 26.3,65.6 26.3,9.5 22.2,9.5 22.2,19.7 18,23.9
  pour Top (no thermals): 26.3,9.5 26.3,13.7 23.5,13.7 22.2,13.7 22.2,9.5
  pour Top (no thermals): 26.3,55.5 26.3,59.7 20.3,59.7 20.3,55.5
  pour Top (no thermals): 26.3,32.5 26.3,36.7 23.5,36.7 22.2,36.7 22.2,32.5
VTEC1
  Top 0.61: R32.2 53,61.48 53,65.5 CON1.P$2
  Top 0.813: C33.1 R32.2
  pour Top (no thermals): 51.5,66.7 51.5,71.1 31.4,71.1 31.4,66.7
VTEC1_FB
  Top 0.254: U1.24 46.53,57.35 47.08,56.8 C33.2
  Top 0.813: R24.1 R33.2 C33.2 R32.1
VTEC1_INTVCC  (via drill 0.3)
  Top 0.254: U1.20 44.65,55.35 46.5,53.5 v46.5,52.7 C30.1 | U1.2 42.95,59.05 v42.7,59.3
  Bottom 0.254: v42.7,59.3 46.5,55.5 v46.5,52.7
VTEC1_RT
  Top 0.254: U1.18 43.45,53.07 R29.2
VTEC1_SS
  Top 0.254: U1.21 44.85,55.85 47.1,53.6 47.1,52.82 C31.1
VTEC1_SW
  pour Top (no thermals): 40.55,54.85 33.95,54.85 31.4,57.4 31.4,61.6 35.7,61.6 35.7,60.9 39.75,56.85 40.55,56.85
VTEC2
  Top 0.61: R3.2 53,38.48 53,42.5 CON2.P$2
  Top 0.813: C8.1 R3.2
  pour Top (no thermals): 51.5,43.7 51.5,48.1 31.4,48.1 31.4,43.7
VTEC2_FB
  Top 0.254: U2.24 46.53,34.35 47.08,33.8 C8.2
  Top 0.813: R6.1 R4.2 C8.2 R3.1
VTEC2_INTVCC  (via drill 0.3)
  Top 0.254: U2.20 44.65,32.35 46.5,30.5 v46.5,29.7 C7.1 | U2.2 42.95,36.05 v42.7,36.3
  Bottom 0.254: v42.7,36.3 46.5,32.5 v46.5,29.7
VTEC2_RT
  Top 0.254: U2.18 43.45,30.07 R2.2
VTEC2_SS
  Top 0.254: U2.21 44.85,32.85 47.1,30.6 47.1,29.82 C6.1
VTEC2_SW
  pour Top (no thermals): 40.55,31.85 33.95,31.85 31.4,34.4 31.4,38.6 35.7,38.6 35.7,37.9 39.75,33.85 40.55,33.85
VTEC3
  Top 0.61: R8.2 53,15.48 53,19.5 CON3.P$2
  Top 0.813: C17.1 R8.2
  pour Top (no thermals): 51.5,20.7 51.5,25.1 31.4,25.1 31.4,20.7
VTEC3_FB
  Top 0.254: U3.24 46.53,11.35 47.08,10.8 C17.2
  Top 0.813: R11.1 R9.2 C17.2 R8.1
VTEC3_INTVCC  (via drill 0.3)
  Top 0.254: U3.20 44.65,9.35 46.5,7.5 v46.5,6.7 C16.1 | U3.2 42.95,13.05 v42.7,13.3
  Bottom 0.254: v42.7,13.3 46.5,9.5 v46.5,6.7
VTEC3_RT
  Top 0.254: U3.18 43.45,7.07 R7.2
VTEC3_SS
  Top 0.254: U3.21 44.85,9.85 47.1,7.6 47.1,6.82 C15.1
VTEC3_SW
  pour Top (no thermals): 40.55,8.85 33.95,8.85 31.4,11.4 31.4,15.6 35.7,15.6 35.7,14.9 39.75,10.85 40.55,10.85
VTEC4  (via drill 0.3)
  Top 0.406: R13.2 v0.7,45.2 | v0.7,27.5 v9,27.5
  Top 0.813: C28.1 R13.2
  Bottom 0.406: v9,27.5 CON5.P$2 | v0.7,45.2 v0.7,27.5
  pour Top (no thermals): 14.7,18.5 19.1,18.5 19.1,35.5 14.7,35.5
VTEC4_FB
  Top 0.254: U4.24 4.95,44.95 4.7,45.2 R13.1
  Top 0.406: R14.2 3.62,49.16 2.6,50.18 R16.1
  Top 0.813: R13.1 C28.2 R14.2
VTEC4_INTVCC  (via drill 0.3)
  Top 0.254: C26.1 6,49.7 5.5,49.2 v5.5,48 5.5,47.4 5.95,46.95 U4.20 | U4.2 7.65,43.55 7,42.9 v6.6,42.9
  Bottom 0.254: v6.6,42.9 5.5,44 v5.5,48
VTEC4_RT
  Top 0.2: U4.18 7.15,50.03 R12.2
VTEC4_SS
  Top 0.254: U4.21 5.89,46.45 4.9,47.44 4.9,49.38 4.3,49.98 C25.1
VTEC4_SW
  pour Top (no thermals): 10.05,47.45 16.65,47.45 19.2,44.9 19.2,40.7 14.9,40.7 14.9,41.4 10.85,45.45 10.05,45.45

### Text on the board
tPlace: DC IN / Max. 24 V | IcyRadio PA TEC Controller v1 / Nov 2020 | - | + | + | - | 1 | + | - | 2 | + | - | 3 | - | + | 4